# Altium schematic sheet ADC-RDC-Power.SchDoc
size A4
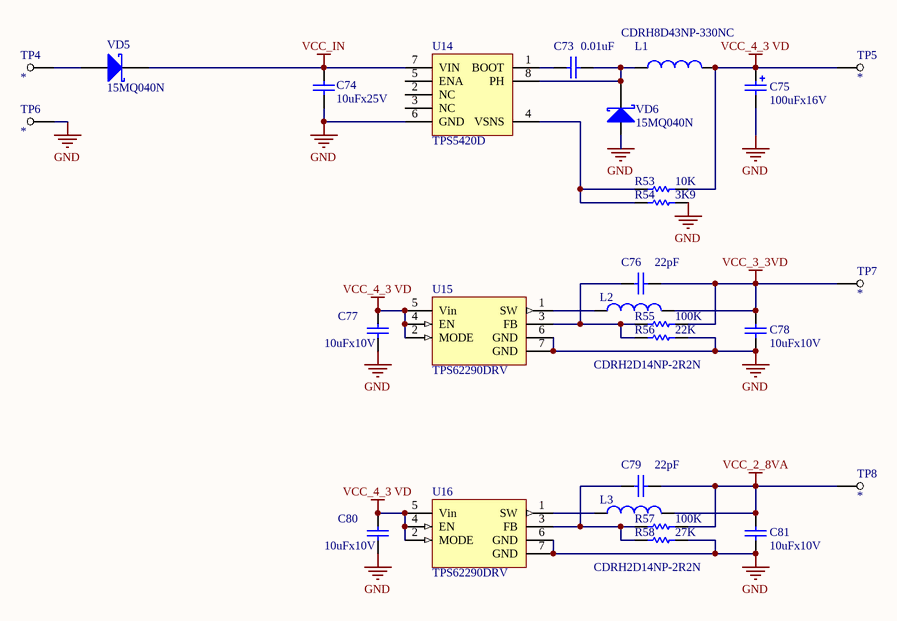
[diagram p0: ADC-RDC-Power.SchDoc]

## Parts
C73  0.01uF  [C0603]
C74  10uFx25V  [C1210]
C75  100uFx16V  [SIZE E]
C76  22pF  [C0603]
C77  10uFx10V  [C0805]
C78  10uFx10V  [C0805]
C79  22pF  [C0603]
C80  10uFx10V  [C0805]
C81  10uFx10V  [C0805]
L1  CDRH8D43NP-330NC  [CDRH8D43]
L2  CDRH2D14NP-2R2N  [CDRH2D18]
L3  CDRH2D14NP-2R2N  [CDRH2D18]
R53  10K  [R0603]
R54  3K9  [R0603]
R55  100K  [R0603]
R56  22K  [R0603]
R57  100K  [R0603]
R58  27K  [R0603]
TP4  *  [TP_18_10]  (no BOM)
TP5  *  [TP_1_06]  (no BOM)
TP6  *  [TP_18_10]  (no BOM)
TP7  *  [TP_1_06]  (no BOM)
TP8  *  [TP_1_06]  (no BOM)
U14  TPS5420D  [SOIC8]
U15  TPS62290DRV  [SON6]
U16  TPS62290DRV  [SON6]
VD5  15MQ040N  [SMA]
VD6  15MQ040N  [SMA]

## Nets
GND: C74.2 C75.2 C77.2 C78.2 C80.2 C81.2 R54.2 R56.2 R58.2 TP6.1 U14.6(GND) U15.6(GND) U15.7(GND) U16.6(GND) U16.7(GND) VD6.1(A)
VCC_2_8VA: C79.1 C81.1 L3.2 R57.2 TP8.1
VCC_3_3VD: C76.1 C78.1 L2.2 R55.2 TP7.1
VCC_4_3 VD: C75.1 C77.1 C80.1 L1.2 R53.2 TP5.1 U15.2(MODE) U15.4(EN) U15.5(Vin) U16.2(MODE) U16.4(EN) U16.5(Vin)
VCC_IN: C74.1 U14.7(VIN) VD5.2(K)
NetC73_1: C73.1 U14.1(BOOT)
NetC73_2: C73.2 L1.1 U14.8(PH) VD6.2(K)
NetC76_2: C76.2 R55.1 R56.1 U15.3(FB)
NetC79_2: C79.2 R57.1 R58.1 U16.3(FB)
NetL2_1: L2.1 U15.1(SW)
NetL3_1: L3.1 U16.1(SW)
NetR53_1: R53.1 R54.1 U14.4(VSNS)
NetTP4_1: TP4.1 VD5.1(A)

Not connected (* = marked no-connect by the designer): U14 2(NC) 3(NC) 5(ENA)

## Library data of the parts
C73 C74 C76-C81 = Cap: Capacitor, 2pin; ValueSCH: *; ValueBOM: *; MarkPCB: *
C75 = Cap Pol: Polarized Capacitor, 2pin; ValueSCH: *; ValueBOM: *; MarkPCB: *
L1-L3 = Inductor: Inductor, 2pin; ValueSCH: *; ValueBOM: *; MarkPCB: *
R53-R58 = RES: Resistor, 2pin; ValueSCH: *; ValueBOM: *; MarkPCB: *
TP4-TP8 = Test_point: Test point; ValueSCH: *; ValueBOM: *; MarkPCB: *
U14 = TPS5420: 2-A, WIDE INPUT RANGE, STEP-DOWN SWIFT™ CONVERTER; ValueSCH: *; ValueBOM: *; MarkPCB: *
U15 U16 = TPS62290: 1-A Step Down Converter in 2 x 2 SON Package; ValueSCH: *; ValueBOM: *; MarkPCB: *
VD5 VD6 = D Schottky: Schottky Diode, 2pin; ValueSCH: *; ValueBOM: *; MarkPCB: *